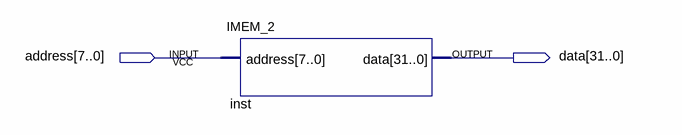
[diagram p0: schematic sheet]
// Quartus schematic IMEM2TEST.bdf as structural Verilog: 1 symbols, 2 pins
module IMEM2TEST (
  input  [7:0] address,
  output [31:0] data
);

  IMEM_2 inst (.address(address), .data(data));
endmodule
